# Altium project Tp_Integrador.PrjPcb
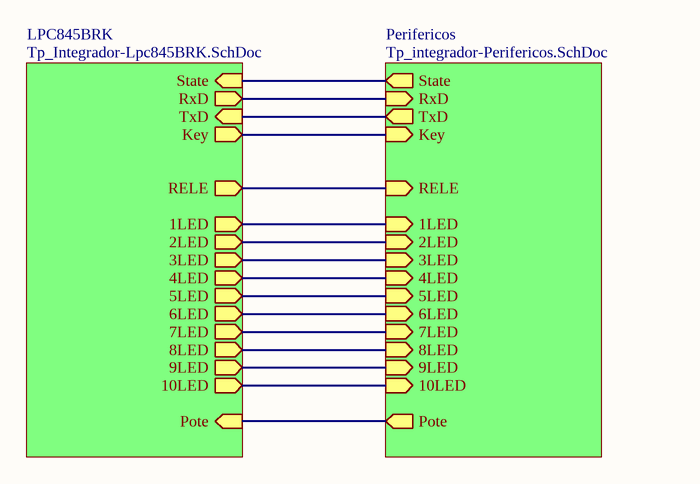
[diagram p0: Tp_Integrador.SchDoc]
3 sheets, 32 parts. Net scope: hierarchical (ports join the sheet entries above them; power ports are global).
Board file: Tp_Integrador.PcbDoc
Sheets:
  Tp_Integrador.SchDoc
    Perifericos = Tp_integrador-Perifericos.SchDoc
    LPC845BRK = Tp_Integrador-Lpc845BRK.SchDoc

## Sheet Tp_Integrador.SchDoc
size A; SheetNumber: 1; SheetTotal: 2

### Sub-sheets
LPC845BRK = Tp_Integrador-Lpc845BRK.SchDoc: State (in), RxD (out), TxD (in), Key (out), RELE (out), 1LED (out), 2LED (out), 3LED (out), 4LED (out), 5LED (out), 6LED (out), 7LED (out), 8LED (out), 9LED (out), 10LED (out), Pote (in)
Perifericos = Tp_integrador-Perifericos.SchDoc: RELE (in), State (out), RxD (in), TxD (out), Key (in), 1LED (in), 2LED (in), 4LED (in), 3LED (in), 5LED (in), 6LED (in), 7LED (in), 8LED (in), 9LED (in), 10LED (in), Pote (out)

### Nets
1LED: sheet Perifericos/1LED, sheet LPC845BRK/1LED
2LED: sheet Perifericos/2LED, sheet LPC845BRK/2LED
3LED: sheet Perifericos/3LED, sheet LPC845BRK/3LED
4LED: sheet Perifericos/4LED, sheet LPC845BRK/4LED
5LED: sheet Perifericos/5LED, sheet LPC845BRK/5LED
6LED: sheet Perifericos/6LED, sheet LPC845BRK/6LED
7LED: sheet Perifericos/7LED, sheet LPC845BRK/7LED
8LED: sheet Perifericos/8LED, sheet LPC845BRK/8LED
9LED: sheet Perifericos/9LED, sheet LPC845BRK/9LED
10LED: sheet Perifericos/10LED, sheet LPC845BRK/10LED
Key: sheet Perifericos/Key, sheet LPC845BRK/Key
Pote: sheet Perifericos/Pote, sheet LPC845BRK/Pote
RELE: sheet Perifericos/RELE, sheet LPC845BRK/RELE
RxD: sheet Perifericos/RxD, sheet LPC845BRK/RxD
State: sheet Perifericos/State, sheet LPC845BRK/State
TxD: sheet Perifericos/TxD, sheet LPC845BRK/TxD

## Sheet Tp_integrador-Perifericos.SchDoc
size A; SheetNumber: 2; SheetTotal: 3
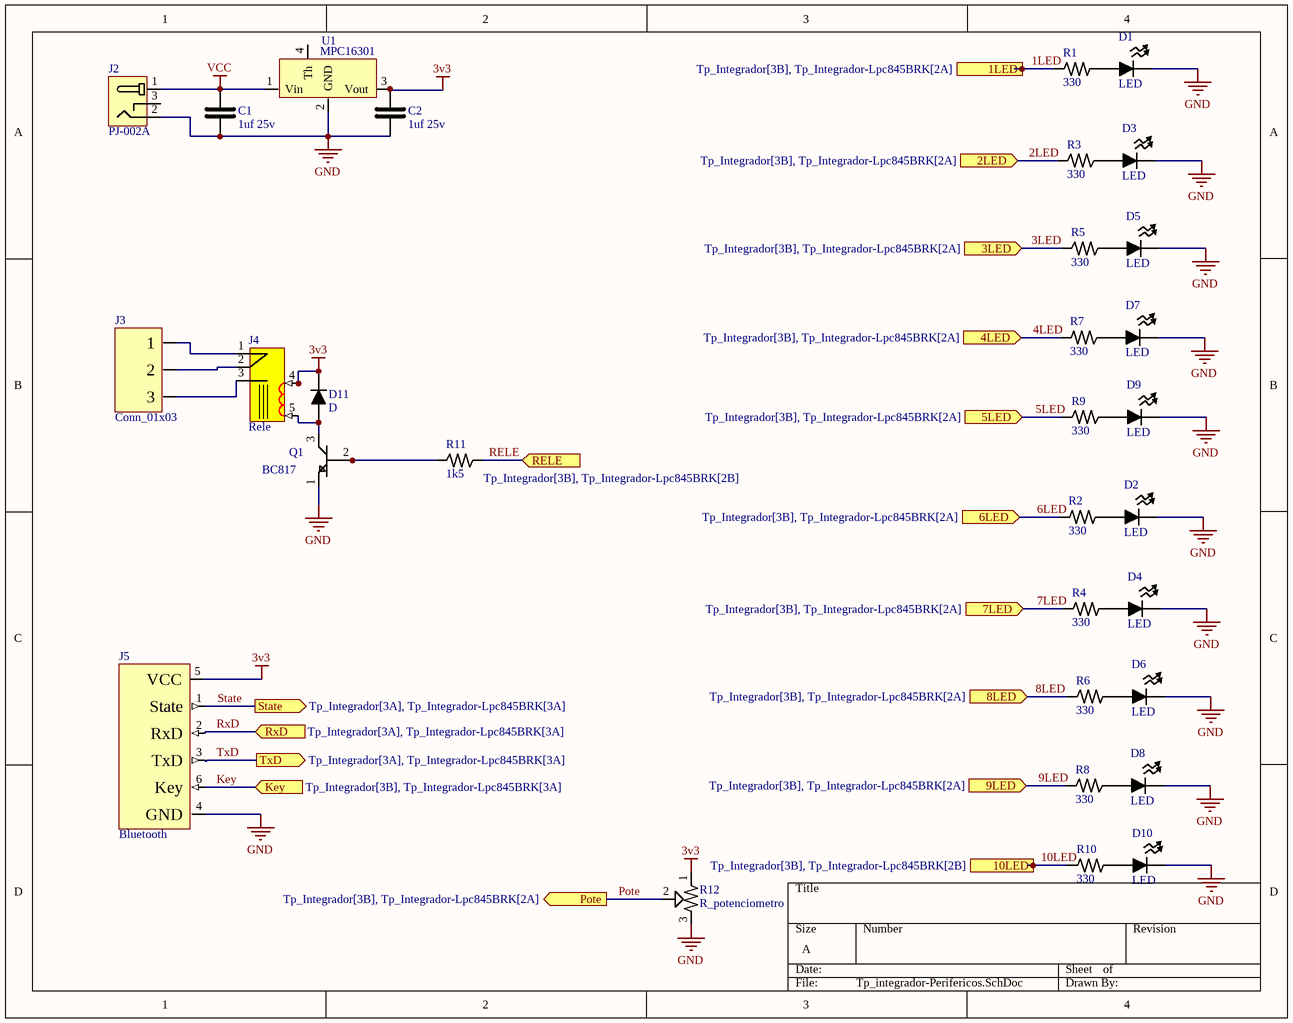
[diagram p1: Tp_integrador-Perifericos.SchDoc]

### Parts
C1  1uf 25v  [C_0805]
C2  1uf 25v  [C_0805]
D1  LED  [LED 5MM]
D2  LED  [LED 5MM]
D3  LED  [LED 5MM]
D4  LED  [LED 5MM]
D5  LED  [LED 5MM]
D6  LED  [LED 5MM]
D7  LED  [LED 5MM]
D8  LED  [LED 5MM]
D9  LED  [LED 5MM]
D10  LED  [LED 5MM]
D11  D  [Diode]
J2  PJ-002A  [Jack]
J3  Conn_01x03  [Bornier]
J4  Rele  [rele]
J5  Bluetooth  [Hc-05]
Q1  BC817  [Transistor]
R1  330  [R_0805]
R2  330  [R_0805]
R3  330  [R_0805]
R4  330  [R_0805]
R5  330  [R_0805]
R6  330  [R_0805]
R7  330  [R_0805]
R8  330  [R_0805]
R9  330  [R_0805]
R10  330  [R_0805]
R11  1k5  [R_0805]
R12  R_potenciometro  [POTE_9.5MM_PTV09-horizontal]
U1  MPC16301  [Regulador]

### Ports
1LED (in, see Tp_Integrador[3B], Tp_Integrador-Lpc845BRK[2A]), 2LED (in, see Tp_Integrador[3B], Tp_Integrador-Lpc845BRK[2A]), 3LED (in, see Tp_Integrador[3B], Tp_Integrador-Lpc845BRK[2A]), 4LED (in, see Tp_Integrador[3B], Tp_Integrador-Lpc845BRK[2A]), 5LED (in, see Tp_Integrador[3B], Tp_Integrador-Lpc845BRK[2A]), 6LED (in, see Tp_Integrador[3B], Tp_Integrador-Lpc845BRK[2A]), 7LED (in, see Tp_Integrador[3B], Tp_Integrador-Lpc845BRK[2A]), 8LED (in, see Tp_Integrador[3B], Tp_Integrador-Lpc845BRK[2A]), 9LED (in, see Tp_Integrador[3B], Tp_Integrador-Lpc845BRK[2A]), 10LED (in, see Tp_Integrador[3B], Tp_Integrador-Lpc845BRK[2B]), Key (in, see Tp_Integrador[3B], Tp_Integrador-Lpc845BRK[3A]), Pote (out, see Tp_Integrador[3B], Tp_Integrador-Lpc845BRK[2A]), RELE (in, see Tp_Integrador[3B], Tp_Integrador-Lpc845BRK[2B]), RxD (in, see Tp_Integrador[3A], Tp_Integrador-Lpc845BRK[3A]), State (out, see Tp_Integrador[3A], Tp_Integrador-Lpc845BRK[3A]), TxD (out, see Tp_Integrador[3A], Tp_Integrador-Lpc845BRK[3A])

### Nets
3v3: C2.1 D11.2(K) J4.4 J5.5(VCC) R12.1 U1.3(Vout)
GND: C1.2 C2.2 D1.2(K) D2.2(K) D3.2(K) D4.2(K) D5.2(K) D6.2(K) D7.2(K) D8.2(K) D9.2(K) D10.2(K) J2.2 J5.4(GND) Q1.1 R12.3 U1.2(GND)
VCC: C1.1 J2.1 U1.1(Vin)
1LED: R1.2 ; port 1LED
2LED: R3.2 ; port 2LED
3LED: R5.2 ; port 3LED
4LED: R7.2 ; port 4LED
5LED: R9.2 ; port 5LED
6LED: R2.2 ; port 6LED
7LED: R4.2 ; port 7LED
8LED: R6.2 ; port 8LED
9LED: R8.2 ; port 9LED
10LED: R10.2 ; port 10LED
Key: J5.6(Key) ; port Key
Pote: R12.2 ; port Pote
RELE: R11.1 ; port RELE
RxD: J5.2(RxD) ; port RxD
State: J5.1(State) ; port State
TxD: J5.3(TxD) ; port TxD
NetD1_1: D1.1(A) R1.1
NetD2_1: D2.1(A) R2.1
NetD3_1: D3.1(A) R3.1
NetD4_1: D4.1(A) R4.1
NetD5_1: D5.1(A) R5.1
NetD6_1: D6.1(A) R6.1
NetD7_1: D7.1(A) R7.1
NetD8_1: D8.1(A) R8.1
NetD9_1: D9.1(A) R9.1
NetD10_1: D10.1(A) R10.1
NetD11_1: D11.1(A) J4.5 Q1.3
NetJ3_1: J3.1 J4.1
NetJ3_2: J3.2 J4.2
NetJ3_3: J3.3 J4.3
NetQ1_2: Q1.2 R11.2

Not connected (* = marked no-connect by the designer): J2 3; U1 4(Th)

### Library data of the parts
C1 C2 = Capacitor Non Polarized_1: Capacitor NP
D11 = D: DIODO
J3 = Conn_01x03: Header 3x1
J5 = Bluetooth: Header 6x1
Q1 = Transistor NPN
R1-R11 = Resistor
U1 = MPC16301: Regulador Lineal

## Sheet Tp_Integrador-Lpc845BRK.SchDoc
size A; SheetNumber: 3; SheetTotal: 3
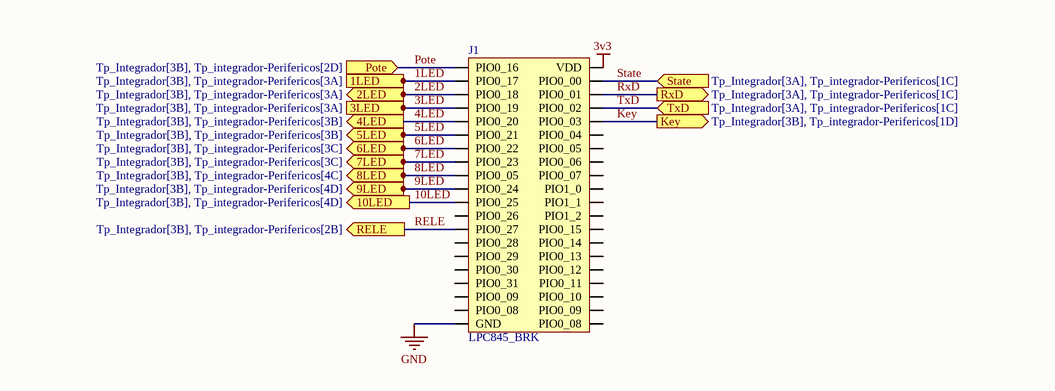
[diagram p2: Tp_Integrador-Lpc845BRK.SchDoc]

### Parts
J1  LPC845_BRK  [LPC845_BRK]

### Ports
1LED (out, see Tp_Integrador[3B], Tp_integrador-Perifericos[3A]), 2LED (out, see Tp_Integrador[3B], Tp_integrador-Perifericos[3A]), 3LED (out, see Tp_Integrador[3B], Tp_integrador-Perifericos[3A]), 4LED (out, see Tp_Integrador[3B], Tp_integrador-Perifericos[3B]), 5LED (out, see Tp_Integrador[3B], Tp_integrador-Perifericos[3B]), 6LED (out, see Tp_Integrador[3B], Tp_integrador-Perifericos[3C]), 7LED (out, see Tp_Integrador[3B], Tp_integrador-Perifericos[3C]), 8LED (out, see Tp_Integrador[3B], Tp_integrador-Perifericos[4C]), 9LED (out, see Tp_Integrador[3B], Tp_integrador-Perifericos[4D]), 10LED (out, see Tp_Integrador[3B], Tp_integrador-Perifericos[4D]), Key (out, see Tp_Integrador[3B], Tp_integrador-Perifericos[1D]), Pote (in, see Tp_Integrador[3B], Tp_integrador-Perifericos[2D]), RELE (out, see Tp_Integrador[3B], Tp_integrador-Perifericos[2B]), RxD (out, see Tp_Integrador[3A], Tp_integrador-Perifericos[1C]), State (in, see Tp_Integrador[3A], Tp_integrador-Perifericos[1C]), TxD (in, see Tp_Integrador[3A], Tp_integrador-Perifericos[1C])

### Nets
3v3: J1.40(VDD)
GND: J1.20(GND)
1LED: J1.2(PIO0_17) ; port 1LED
2LED: J1.3(PIO0_18) ; port 2LED
3LED: J1.4(PIO0_19) ; port 3LED
4LED: J1.5(PIO0_20) ; port 4LED
5LED: J1.6(PIO0_21) ; port 5LED
6LED: J1.7(PIO0_22) ; port 6LED
7LED: J1.8(PIO0_23) ; port 7LED
8LED: J1.9(PIO0_05) ; port 8LED
9LED: J1.10(PIO0_24) ; port 9LED
10LED: J1.11(PIO0_25) ; port 10LED
Key: J1.36(PIO0_03) ; port Key
Pote: J1.1(PIO0_16) ; port Pote
RELE: J1.13(PIO0_27) ; port RELE
RxD: J1.38(PIO0_01) ; port RxD
State: J1.39(PIO0_00) ; port State
TxD: J1.37(PIO0_02) ; port TxD

Not connected (* = marked no-connect by the designer): J1 12(PIO0_26) 14(PIO0_28) 15(PIO0_29) 16(PIO0_30) 17(PIO0_31) 18(PIO0_09) 19(PIO0_08) 21(PIO0_08) 22(PIO0_09) 23(PIO0_10) 24(PIO0_11) 25(PIO0_12) 26(PIO0_13) 27(PIO0_14) 28(PIO0_15) 29(PIO1_2) 30(PIO1_1) 31(PIO1_0) 32(PIO0_07) 33(PIO0_06) 34(PIO0_05) 35(PIO0_04)

### Library data of the parts
J1 = LPC845_BRK: LPC845 breakoutBoard

## Nets that join several sheets
3v3: Tp_integrador-Perifericos (6 pins), Tp_Integrador-Lpc845BRK (J1.40)
GND: Tp_integrador-Perifericos (17 pins), Tp_Integrador-Lpc845BRK (J1.20)
1LED: Tp_integrador-Perifericos (R1.2), Tp_Integrador-Lpc845BRK (J1.2)
2LED: Tp_integrador-Perifericos (R3.2), Tp_Integrador-Lpc845BRK (J1.3)
3LED: Tp_integrador-Perifericos (R5.2), Tp_Integrador-Lpc845BRK (J1.4)
4LED: Tp_integrador-Perifericos (R7.2), Tp_Integrador-Lpc845BRK (J1.5)
5LED: Tp_integrador-Perifericos (R9.2), Tp_Integrador-Lpc845BRK (J1.6)
6LED: Tp_integrador-Perifericos (R2.2), Tp_Integrador-Lpc845BRK (J1.7)
7LED: Tp_integrador-Perifericos (R4.2), Tp_Integrador-Lpc845BRK (J1.8)
8LED: Tp_integrador-Perifericos (R6.2), Tp_Integrador-Lpc845BRK (J1.9)
9LED: Tp_integrador-Perifericos (R8.2), Tp_Integrador-Lpc845BRK (J1.10)
10LED: Tp_integrador-Perifericos (R10.2), Tp_Integrador-Lpc845BRK (J1.11)
Key: Tp_integrador-Perifericos (J5.6), Tp_Integrador-Lpc845BRK (J1.36)
Pote: Tp_integrador-Perifericos (R12.2), Tp_Integrador-Lpc845BRK (J1.1)
RELE: Tp_integrador-Perifericos (R11.1), Tp_Integrador-Lpc845BRK (J1.13)
RxD: Tp_integrador-Perifericos (J5.2), Tp_Integrador-Lpc845BRK (J1.38)
State: Tp_integrador-Perifericos (J5.1), Tp_Integrador-Lpc845BRK (J1.39)
TxD: Tp_integrador-Perifericos (J5.3), Tp_Integrador-Lpc845BRK (J1.37)